# Altium schematic sheet Controller-Board.SchDoc
size A4
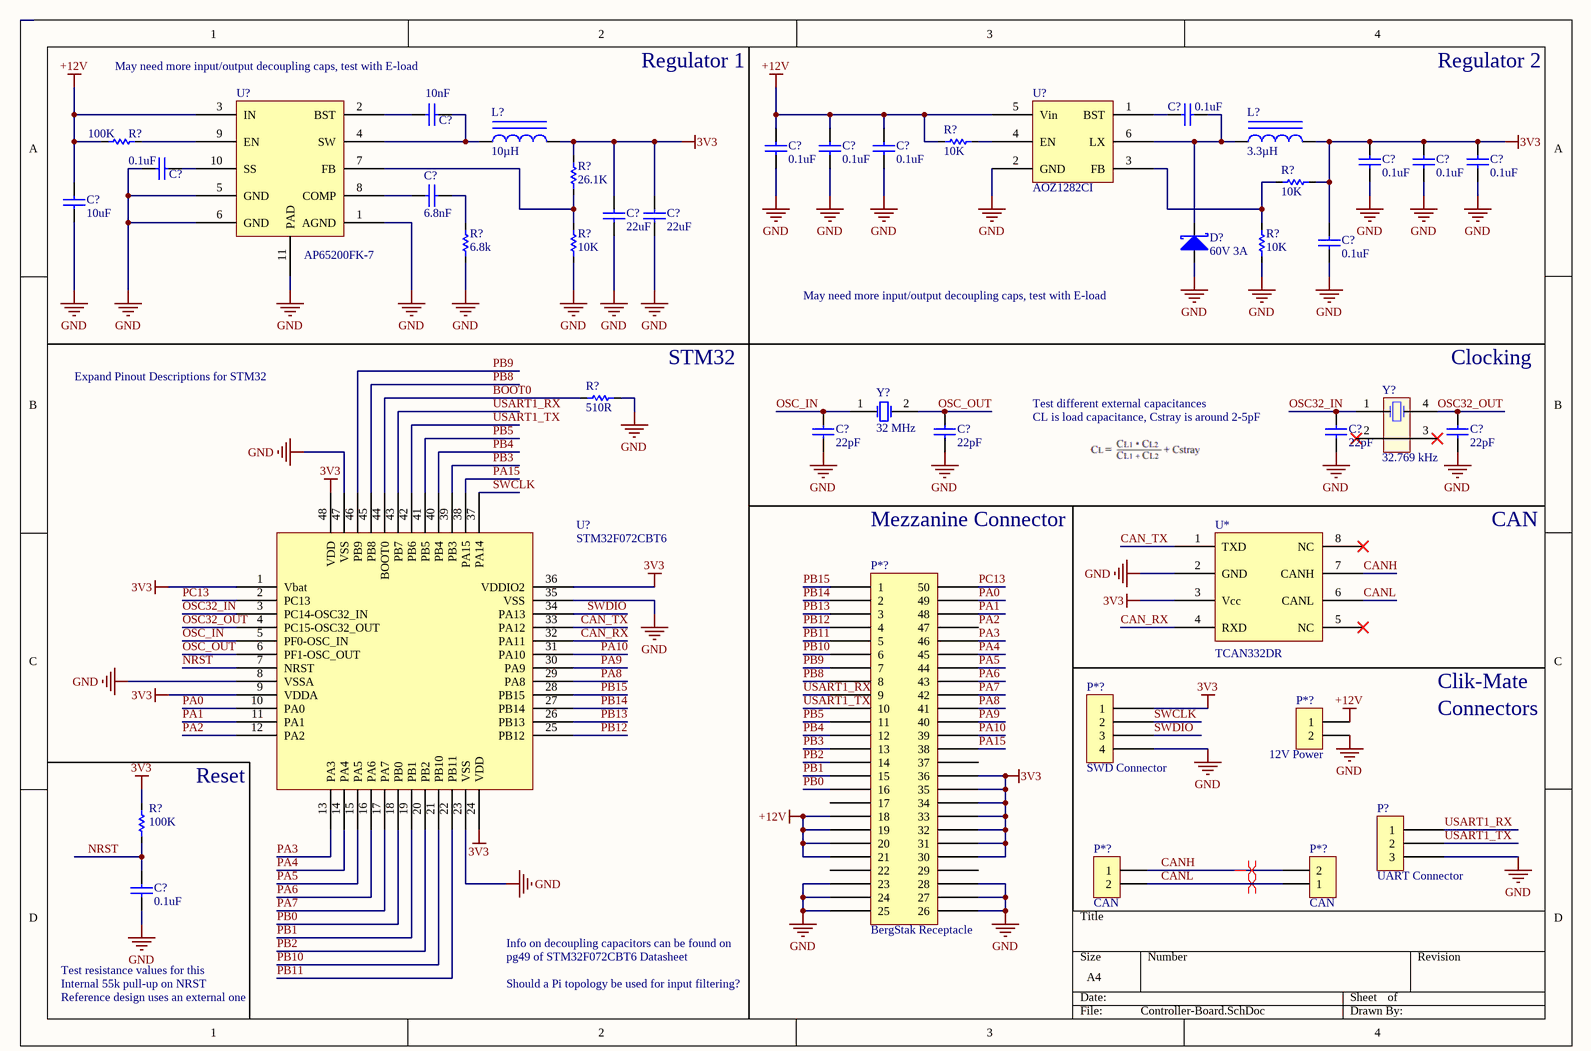
[diagram p0: Controller-Board.SchDoc]

## Parts
(Parts that share a designator on the sheet are numbered #1, #2 ... from top to bottom, then left to right.)
C?#1  10nF  [0402]
C?#2  0.1uF  [C0805]
C?#3  0.1uF  [C0805]
C?#4  0.1uF  [C0805]
C?#5  0.1uF  [C0805]
C?#6  0.1uF  [C0805]
C?#7  0.1uF  [C0805]
C?#8  0.1uF  [C0805]
C?#9  0.1uF  [C0805]
C?#10  10uF  [C0805]
C?#11  6.8nF  [C0805]
C?#12  22uF  [C0805]
C?#13  22uF  [C0805]
C?#14  0.1uF  [C0805]
C?#15  22pF  [1608[0603]]
C?#16  22pF  [1608[0603]]
C?#17  22pF  [1608[0603]]
C?#18  22pF  [1608[0603]]
C?#19  0.1uF  [C0805]
D?  60V 3A  [SMA]
L?#1  10µH  [C1210_N]
L?#2  3.3µH  [445-172964-1-ND]
P*?#1  SWD Connector
P*?#2  12V Power
P*?#3  BergStak Receptacle
P*?#4  CAN
P*?#5  CAN
P?  UART Connector
R?#1  100K  [6-0805_N]
R?#2  10K  [6-0805_N]
R?#3  26.1K  [6-0805_N]
R?#4  10K  [6-0805_N]
R?#5  6.8k  [6-0805_N]
R?#6  10K  [6-0805_N]
R?#7  10K  [6-0805_N]
R?#8  510R  [6-0805_N]
R?#9  100K  [6-0805_N]
U*  Manufacturer Part Number: TCAN332DR  (hidden comment: TCAN332DR CAN Transceiver)
U?#1  Manufacturer Part Number: AOZ1282CI  [SOT23-6_M]  (hidden comment: AOZ1282CI Buck Switching Regulator)
U?#2  Manufacturer Part Number: AP65200FK-7  [10-UFDFN]  (hidden comment: AP65200FK-7 Buck Switching Regulator)
U?#3  STM32F072CBT6  [48-LQFP]
Y?#1  32 MHz  [HC49]
Y?#2  value 32.769 kHz  [4-SOJ]

## Nets
3V3: C?#6.2 C?#7.2 C?#8.2 C?#12.2 C?#13.2 C?#14.2 L?#1.2 L?#2.2 P*?#1.1 P*?#3.30 P*?#3.31 P*?#3.32 P*?#3.33 P*?#3.34 P*?#3.35 P*?#3.36 R?#3.2 R?#4.1 R?#9.2 U*.3(Vcc) U?#3.1(Vbat) U?#3.9(VDDA) U?#3.24(VDD) U?#3.36(VDDIO2) U?#3.48(VDD)
+12V: C?#3.2 C?#4.2 C?#5.2 C?#10.2 P*?#2.1 P*?#3.18 P*?#3.19 P*?#3.20 P*?#3.21 R?#1.1 R?#2.1 U?#1.5(Vin) U?#2.3(IN)
GND: C?#3.1 C?#4.1 C?#5.1 C?#6.1 C?#7.1 C?#8.1 C?#9.1 C?#10.1 C?#12.1 C?#13.1 C?#14.1 C?#15.1 C?#16.1 C?#17.1 C?#18.1 C?#19.1 D?.1 P*?#1.4 P*?#2.2 P*?#3.23 P*?#3.24 P*?#3.25 P*?#3.26 P*?#3.27 P*?#3.28 P?.3 R?#5.1 R?#6.1 R?#7.1 R?#8.2 U*.2(GND) U?#1.2(GND) U?#2.1(AGND) U?#2.5(GND) U?#2.6(GND) U?#2.11(PAD) U?#3.8(VSSA) U?#3.23(VSS) U?#3.35(VSS) U?#3.47(VSS)
BOOT0: R?#8.1 U?#3.44(BOOT0)
CAN_RX: U*.4(RXD) U?#3.32(PA11)
CAN_TX: U*.1(TXD) U?#3.33(PA12)
CANH: P*?#4.2 P*?#5.1 U*.7(CANH)
CANL: P*?#4.1 P*?#5.2 U*.6(CANL)
NRST: C?#19.2 R?#9.1 U?#3.7(NRST)
OSC32_IN: C?#17.2 U?#3.3(PC14-OSC32_IN) Y?#2.1(OSC1)
OSC32_OUT: C?#18.2 U?#3.4(PC15-OSC32_OUT) Y?#2.4(OSC2)
OSC_IN: C?#15.2 U?#3.5(PF0-OSC_IN) Y?#1.1(OSC1)
OSC_OUT: C?#16.2 U?#3.6(PF1-OSC_OUT) Y?#1.2(OSC2)
PA0: P*?#3.49 U?#3.10(PA0)
PA1: P*?#3.48 U?#3.11(PA1)
PA2: P*?#3.47 U?#3.12(PA2)
PA3: P*?#3.46 U?#3.13(PA3)
PA4: P*?#3.45 U?#3.14(PA4)
PA5: P*?#3.44 U?#3.15(PA5)
PA6: P*?#3.43 U?#3.16(PA6)
PA7: P*?#3.42 U?#3.17(PA7)
PA8: P*?#3.41 U?#3.29(PA8)
PA9: P*?#3.40 U?#3.30(PA9)
PA10: P*?#3.39 U?#3.31(PA10)
PA15: P*?#3.38 U?#3.38(PA15)
PB0: P*?#3.16 U?#3.18(PB0)
PB1: P*?#3.15 U?#3.19(PB1)
PB2: P*?#3.14 U?#3.20(PB2)
PB3: P*?#3.13 U?#3.39(PB3)
PB4: P*?#3.12 U?#3.40(PB4)
PB5: P*?#3.11 U?#3.41(PB5)
PB8: P*?#3.8 U?#3.45(PB8)
PB9: P*?#3.7 U?#3.46(PB9)
PB10: P*?#3.6 U?#3.21(PB10)
PB11: P*?#3.5 U?#3.22(PB11)
PB12: P*?#3.4 U?#3.25(PB12)
PB13: P*?#3.3 U?#3.26(PB13)
PB14: P*?#3.2 U?#3.27(PB14)
PB15: P*?#3.1 U?#3.28(PB15)
PC13: P*?#3.50 U?#3.2(PC13)
SWCLK: P*?#1.2 U?#3.37(PA14)
SWDIO: P*?#1.3 U?#3.34(PA13)
USART1_RX: P*?#3.9 P?.1 U?#3.43(PB7)
USART1_TX: P*?#3.10 P?.2 U?#3.42(PB6)
NetC?#1_1: C?#1.1 U?#2.2(BST)
NetC?#1_2: C?#1.2 L?#1.1 U?#2.4(SW)
NetC?#2_1: C?#2.1 U?#1.1(BST)
NetC?#2_2: C?#2.2 D?.2 L?#2.1 U?#1.6(LX)
NetC?#9_2: C?#9.2 U?#2.10(SS)
NetC?#11_1: C?#11.1 U?#2.8(COMP)
NetC?#11_2: C?#11.2 R?#5.2
NetR?#1_2: R?#1.2 U?#2.9(EN)
NetR?#2_2: R?#2.2 U?#1.4(EN)
NetR?#3_1: R?#3.1 R?#6.2 U?#2.7(FB)
NetR?#4_2: R?#4.2 R?#7.2 U?#1.3(FB)

Not connected (* = marked no-connect by the designer): P*?#3 17 22 29 37; U* 5(NC)* 8(NC)*; Y?#2 2* 3*

## Layout directives
differential pair: CANH, CANL

## Notes on the sheet
- May need more input/output decoupling caps, test with E-load
- Regulator 1
- Regulator 2
- (near D?) May need more input/output decoupling caps, test with E-load
- Expand Pinout Descriptions for STM32
- STM32
- Clocking
- Test different external capacitances
- (near C?#17) CL is load capacitance, Cstray is around 2-5pF
- Mezzanine Connector
- CAN
- Clik-Mate
- Connectors
- (near U?#3) Reset
- Test resistance values for this
- Internal 55k pull-up on NRST
- Reference design uses an external one
- Info on decoupling capacitors can be found on
- Should a Pi topology be used for input filtering?
- pg49 of STM32F072CBT6 Datasheet

## Library data of the parts
C?#1 = CAP CER 10nF 50V 10% X7R 0805: 10000pF 50V Ceramic Capacitor X7R 0402 (1005 Metric) 0.039" L x 0.020" W (1.00mm x 0.50mm); Manufacturer: Murata Electronics North America; ManufacturerPartNumber: GRM155R71H103KA88D; Value: 10nF; Supplier: Digi-Key; SupplierPartNumber: 490-4516-1-ND; Supplier 1: Digi-Key
C?#2-C?#9 C?#14 C?#19 = CAP CER 0.1UF 50V 10% X7R 0805: 0.10µF 50V Ceramic Capacitor X7R 0805 (2012 Metric) 0.079" L x 0.049" W (2.00mm x 1.25mm); Manufacturer: AVX Corporation; ManufacturerPartNumber: 08055C104K4Z2A; Value: 0.1uF; Supplier: Digi-Key; SupplierPartNumber: 478-6048-1-ND; Supplier 1: Digi-Key
C?#10 = CAP CER 10uF 50V 10% X7R 0805: 10µF 25V Ceramic Capacitor X5R 0805 (2012 Metric) 0.079" L x 0.049" W (2.00mm x 1.25mm); Manufacturer: Samsung Electro-Mechanics America, Inc.; ManufacturerPartNumber: CL21A106KAFN3NE; Value: 10uF; Supplier: Digi-Key; SupplierPartNumber: 1276-2890-1-ND; Supplier 1: Digi-Key
C?#11 = CAP CER 6.8nF 50V 10% X7R 0805: 6800pF 50V Ceramic Capacitor X7R 0805 (2012 Metric) 0.079" L x 0.049" W (2.00mm x 1.25mm); Manufacturer: Samsung Electro-Mechanics America, Inc.; ManufacturerPartNumber: CL21B682KBANNNC; Value: 6.8nF; Supplier: Digi-Key; SupplierPartNumber: 1276-1799-1-ND; Supplier 1: Digi-Key
C?#12 C?#13 = CAP CER 22uF 25V 20% X5R 0805: 22µF 25V Ceramic Capacitor X5R 0805 (2012 Metric) 0.079" L x 0.049" W (2.00mm x 1.25mm); Manufacturer: Murata Electronics North America; ManufacturerPartNumber: GRT21BR61E226ME13L; Value: 22uF; Supplier: Digi-Key; SupplierPartNumber: 490-12389-1-ND; Supplier 1: Digi-Key
C?#15-C?#18 = CAP CER 20PF 100V 5% NP0 0603: 22pF 100V Ceramic Capacitor C0G, NP0 0603 (1608 Metric) 0.063" L x 0.031" W (1.60mm x 0.80mm); ManufacturerPartNumber: GCM1885C2A220JA16D; Manufacturer: Murata Electronics North America; Value: 22pF; SupplierPartNumber: 490-4942-1-ND; Supplier: Digi-Key; Supplier 1: Digi-Key
D? = Schottky Diode 60V 3A: DIODE SCHOTTKY 60V 3A SMA; Manufacturer Part Number: B360A-13-F; Digikey Part Number: B360A-FDICT-ND; Supplier 1: Digi-Key
L?#1 = IND 10UH POWDERED IRON 0.9A: 10µH Shielded Wirewound Inductor 900mA 420 mOhm Max 1210 (3225 Metric); Manufacturer: Murata Electronics North America; Manufacturer Part Number: 1277AS-H-100M=P2; Tolerance: ±20%; Current Rating: 0.9A; Current - Saturation: 1.25A; Supplier 1: Digi-Key; Supplier Part Number 1: 490-10589-1-ND; Type: Wirewound; Shielding: Shielded; DC Resistance (DCR): 420 mOhm Max; Height - Seated (Max): 0.047" (1.20mm); ComponentLink1URL: http://www.toko.co.jp/products-murata/pdf/inductors/m_dfe322512c.pdf; ComponentLink1Description: datasheet; Inductance: 10µH
L?#2 = IND 3.3UH FERRITE 1.04A: Manufacturer: TDK Corporation; Manufacturer Part Number: VLS201612CX-3R3M; Type: Wirewound; Tolerance: ±20%; Current Rating: 1.37A; Current - Saturation: 1.04A; Shielding: Shielded; DC Resistance (DCR): 170 mOhm Max; Frequency - Test: 1MHz; Inductance: 47µH; Supplier 1: Digi-Key; Supplier Part Number 1: 445-172964-1-ND; RoHS: RoHS Compliant; Category: Inductors, Coils, Chokes; Stock 1: 4000; Pricing 1: 1=0.43, 10=0.387, 50=0.3014, 100=0.2798, 500=0.24538, 1000=0.19803 (USD); Packaging: Cut Tape (CT); Material - Core: Ferrite; Q @ Freq: -; Frequency - Self Resonant: -; Operating Temperature: -40°C ~ 105°C; Mounting Type: Surface Mount; Package / Case: Nonstandard; Size / Dimension: 0.079" L x 0.063" W (2.00mm x 1.60mm); Height - Seated (Max): 0.047" (1.20mm); Supplier Device Package: 2016; ComponentLink1URL: http://product.tdk.com/en/catalog/datasheets/inductor_commercial_power_vls-cx_en.pdf; ComponentLink1Description: http://product.tdk.com/en/catalog/datasheets/inductor_commercial_power_vls-cx_en.pdf
P*?#1 = 4 Position Clik-Mate SWD Connector: 4 Position Receptacle Connector 0.059" (1.50mm) Surface Mount Gold; Maufacturer Part Number: 5054050470; Digikey Part Number: WM12858CT-ND
P*?#2 = 2 Position Clik-Mate 12V Connector: 2 Position Receptacle Connector 0.059" (1.50mm) Surface Mount Tin; Manufacturer Part Number: 5025840270; Digikey Part Number: WM9811CT-ND
P*?#3 = BergStak 50 Position Connector Receptacle: 50 Position Connector Receptacle, Center Strip Contacts Surface Mount Gold; Manufacturer Part Number: 10132798-052100LF; Digikey Part Number: 609-5227-1-ND
P*?#4 P*?#5 = 2 Position Clik-Mate CAN Connector: 2 Position Receptacle Connector 0.049" (1.25mm) Surface Mount Tin; Manufacturer Part Number: 5023820270; Digikey Part Number: WM4780CT-ND
P? = 3 Position Clik-Mate UART Connector: 3 Position Receptacle Connector 0.049" (1.25mm) Surface Mount Tin; Maufacturer Part Number: 5023820370; Digikey Part Number: WM3918CT-ND; ComponentLink1Description: datasheet; ComponentLink1URL: http://www.molex.com/pdm_docs/sd/5023820370_sd.pdf
R?#1 R?#9 = RES 100K OHM 1/8W 5% 0805 SMD: RES SMD 100K OHM 1% 1/8W 0805; ManufacturerPartNumber: RC0805FR-07100KL; Manufacturer: Yageo; Value: 100K; Supplier: Digi-Key; SupplierPartNumber: 311-100KCRCT-ND; Supplier 1: Digi-Key
R?#2 R?#4 R?#6 R?#7 = RES 10K OHM 1/8W 5% 0805 SMD: ManufacturerPartNumber: CRCW080510K0JNEA; Manufacturer: Vishay Dale; Value: 10K; Supplier: Digi-Key; SupplierPartNumber: 541-10KACT-ND; Supplier 1: Digi-Key
R?#3 = RES 26.1K OHM 1/8W 5% 0805 SMD: RES SMD 26.1K OHM 1% 1/8W 0805; ManufacturerPartNumber: RC0805FR-0726K1L; Manufacturer: Yageo; Value: 26.1K; Supplier: Digi-Key; SupplierPartNumber: 311-26.1KCRCT-ND; Supplier 1: Digi-Key
R?#5 = RES 6.8k OHM 1/8W 0805 SMD: RES SMD 6.8K OHM 5% 1/8W 0805; ManufacturerPartNumber: RC0805JR-076K8L; Manufacturer: Yageo; Value: 6.8k; Supplier: Digi-Key; SupplierPartNumber: 311-6.8KARCT-ND; Supplier 1: Digi-Key
R?#8 = RES 510 OHM 1/8W 0805 SMD: RES SMD 510 OHM 5% 1/8W 0805; ManufacturerPartNumber: RMCF0805JT510R; Manufacturer: Stackpole Electronics Inc.; Value: 510R; Supplier: Digi-Key; SupplierPartNumber: RMCF0805JT510RCT-ND; Supplier 1: Digi-Key
U* = TCAN332DR CAN Transceiver: 1/1 Transceiver CAN 8-SOIC; Digikey Part Number: 296-43711-1-ND
U?#1 = AOZ1282CI Buck Switching Regulator: IC REG BUCK ADJ 1.2A SOT23-6; Digikey Part Number: 785-1613-1-ND; Supplier 1: Digi-Key; Supplier Part Number 1: 785-1613-1-ND
U?#2 = AP65200FK-7 Buck Switching Regulator: Buck Switching Reg IC Positive Adjustable 0.925V 1 Output 2A 10-UFDFN Exposed Pad; Digikey Part Number: AP65200FK-7DICT-ND; Supplier 1: Digi-Key; Supplier Part Number 1: AP65200FK-7DICT-ND
Y?#1 = CRYSTAL 32.000 MHZ 18PF +-30ppm SMD: 32MHz ±30ppm Crystal 18pF 40 Ohm -40°C ~ 85°C Surface Mount HC49/US; ManufacturerPartNumber: ABLS2-32.000MHZ-D4YF-T; Manufacturer: Abracon LLC; Supplier: Digi-Key; SupplierPartNumber: 535-9888-1-ND; Supplier 1: Digi-Key; Supplier Part Number 1: 535-9888-1-ND
Y?#2 = CRYSTAL 32.768 kHz 6pF +-20ppm SMD 4-SOJ: 32.768kHz ±20ppm Crystal 6pF 50 kOhm -40°C ~ 85°C Surface Mount 4-SOJ, 5.50mm pitch; Manufacturer Part Number: ABS25-32.768KHZ-6-T; Digikey Part Number: 535-10240-1-ND; Supplier 1: Digi-Key; Supplier Part Number 1: 535-10240-1-ND
U?#3 = STM32F072CBT6: Digikey Part Number: 497-14645-ND; Supplier 1: Digi-Key; Supplier Part Number 1: 497-14645-ND